# Altium schematic sheet Sheet1.SchDoc
size A; SheetNumber: 1; SheetTotal: 1
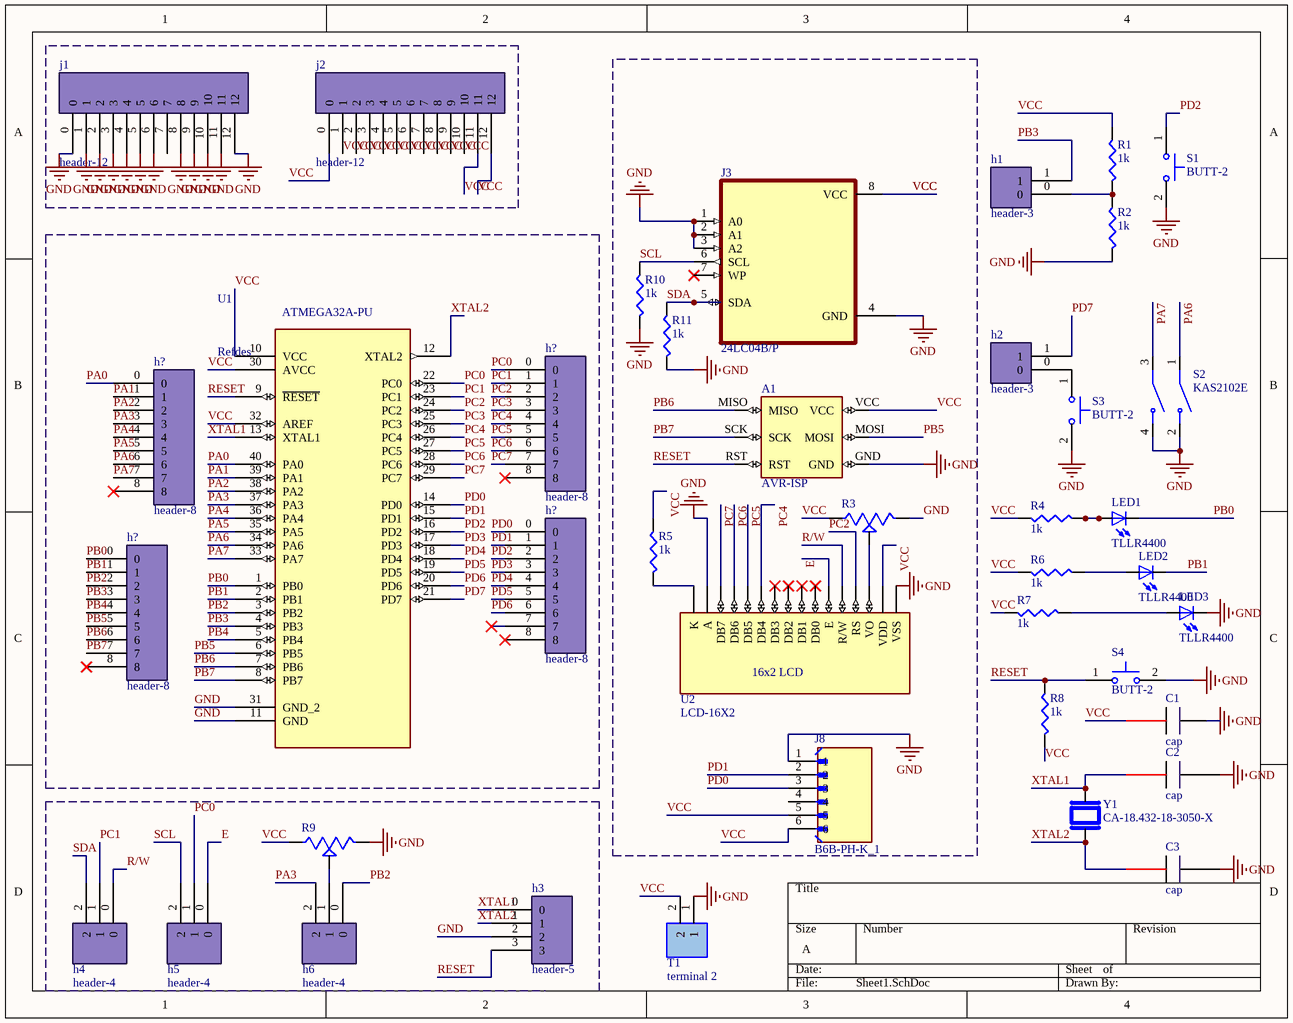
[diagram p0: Sheet1.SchDoc]

## Parts
(Parts that share a designator on the sheet are numbered #1, #2 ... from top to bottom, then left to right.)
A1  AVR-ISP  [AVR-ISP]
C1  cap  [cap]
C2  cap  [cap]
C3  cap  [cap]
h1  header-3  [Male_header_3]
h2  header-3  [Male_header_3]
h3  header-5  [Male_header_5]
h4  header-4  [Male_header_4]
h5  header-4  [Male_header_4]
h6  header-4  [Male_header_4]
h?#1  header-8  [male header 8x2.54]
h?#2  header-8  [male header 8x2.54]
h?#3  header-8  [male header 8x2.54]
h?#4  header-8  [male header 8x2.54]
j1  header-12  [male header 8x2.54]
j2  header-12  [male header 8x2.54]
J3  24LC04B/P  [DIP787W46P254L927H533Q8]
J8  B6B-PH-K_1  [JST_B6B-PH-K]
LED1  TLLR4400  [LED3MM]
LED2  TLLR4400  [LED3MM]
LED3  TLLR4400  [LED3MM]
R1  1k  [R_THT_CFR-25]
R2  1k  [R_THT_CFR-25]
R3  PTN16-A50220K1B1  [POT_PTN16-A50220K1B1]  (value not drawn)
R4  1k  [R_THT_CFR-25]
R5  1k  [R_THT_CFR-25]
R6  1k  [R_THT_CFR-25]
R7  1k  [R_THT_CFR-25]
R8  1k  [R_THT_CFR-25]
R9  PTN16-A50220K1B1  [POT_PTN16-A50220K1B1]  (value not drawn)
R10  1k  [R_THT_CFR-25]
R11  1k  [R_THT_CFR-25]
S1  BUTT-2  [SW_BUTT-2]
S2  KAS2102E  [SW_KAS2102E]
S3  BUTT-2  [SW_BUTT-2]
S4  BUTT-2  [SW_BUTT-2]
T1  terminal 2  [CONN2_0393800102_524X492_MOL]
U1  ATMEGA32A-PU  [3M_240-1280-00-0602J]  (value not drawn)
U2  LCD-16X2  [MODULE_LCD-16X2]
Y1  CA-18.432-18-3050-X  [XTAL_CA-18.432-18-3050-X]

## Nets
GND: A1.GND C1.2 C2.2 C3.2 h3.2 j1.0 j1.1 j1.2 j1.3 j1.4 j1.5 j1.6 j1.8 j1.9 j1.10 j1.11 j1.12 J3.1(A0) J3.2(A1) J3.3(A2) J3.4(GND) J8.1 LED3.K(C) R2.1 R3.3 R9.3 R10.1 R11.1 S1.2 S2.2(NO1) S2.4(NO2) S3.2 S4.2 T1.1 U1.11(GND) U1.31(GND_2) U2.1(VSS) U2.15(A)
E: h5.0 U2.6(E)
PA0: h?#2.0 U1.40(PA0)
PA1: h?#2.1 U1.39(PA1)
PA2: h?#2.2 U1.38(PA2)
PA3: h6.2 h?#2.3 U1.37(PA3)
PA4: h?#2.4 U1.36(PA4)
PA5: h?#2.5 U1.35(PA5)
PA6: h?#2.6 S2.1(COM1) U1.34(PA6)
PA7: h?#2.7 S2.3(COM2) U1.33(PA7)
PB0: h?#4.0 LED1.K(C) U1.1(PB0)
PB1: h?#4.1 LED2.K(C) U1.2(PB1)
PB2: h6.0 h?#4.2 U1.3(PB2)
PB3: h1.1 h?#4.3 U1.4(PB3)
PB4: h?#4.4 U1.5(PB4)
PB5: A1.MOSI h?#4.5 U1.6(PB5)
PB6: A1.MISO h?#4.6 U1.7(PB6)
PB7: A1.SCK h?#4.7 U1.8(PB7)
PC0: h5.1 h?#1.0 U1.22(PC0)
PC1: h4.1 h?#1.1 U1.23(PC1)
PC2: h?#1.2 U1.24(PC2) U2.4(RS)
PC3: h?#1.3 U1.25(PC3)
PC4: h?#1.4 U1.26(PC4) U2.11(DB4)
PC5: h?#1.5 U1.27(PC5) U2.12(DB5)
PC6: h?#1.6 U1.28(PC6) U2.13(DB6)
PC7: h?#1.7 U1.29(PC7) U2.14(DB7)
PD0: h?#3.0 J8.3 U1.14(PD0)
PD1: h?#3.1 J8.2 U1.15(PD1)
PD2: h?#3.2 S1.1 U1.16(PD2)
PD3: h?#3.3 U1.17(PD3)
PD4: h?#3.4 U1.18(PD4)
PD5: h?#3.5 U1.19(PD5)
PD6: h?#3.6 U1.20(PD6)
PD7: h2.1 U1.21(PD7)
R/W: h4.0 U2.5(R/W)
RESET: A1.RST h3.3 R8.2 S4.1 U1.9(~{RESET})
SCL: h5.2 J3.6(SCL) R10.2
SDA: h4.2 J3.5(SDA) R11.2
VCC: A1.VCC C1.1 j2.0 j2.1 j2.2 j2.3 j2.4 j2.5 j2.6 j2.7 j2.8 j2.9 j2.10 j2.11 j2.12 J3.8(VCC) J8.5 J8.6 R1.2 R3.1 R4.1 R5.1 R6.1 R7.2 R8.1 R9.1 T1.2 U1.10(VCC) U1.30(AVCC) U1.32(AREF) U2.2(VDD)
XTAL1: C2.1 h3.0 U1.13(XTAL1) Y1.2
XTAL2: C3.1 h3.1 U1.12(XTAL2) Y1.1
Neth1_0: h1.0 R1.1 R2.2
Neth2_0: h2.0 S3.1
Neth6_1: h6.1 R9.2
NetLED1_A: LED1.A R4.2
NetLED2_A: LED2.A R6.2
NetLED3_A: LED3.A R7.1
NetR3_2: R3.2 U2.3(VO)
NetR5_2: R5.2 U2.16(K)

Not connected (* = marked no-connect by the designer): h?#1 8*; h?#2 8*; h?#3 7* 8*; h?#4 8*; j1 7; J3 7(WP)*; J8 4; U2 7(DB0)* 8(DB1)* 9(DB2)* 10(DB3)*

## Notes on the sheet
- (in symbol ATMEGA32A-PU) Refdes
- (in symbol LCD-16X2) 16x2 LCD

## Library data of the parts
A1 = AVR-ISP: Emulators / Simulators AVR USB IN CIRCUIT EMUL/PRGMR ISP; MF: Gravitech; SnapEDA_Link: https://www.snapeda.com/parts/AVR-ISP/Gravitech/view-part/4593377/?ref=snap; MP: AVR-ISP; Availability: Unavailable; Price: None; Value: *; Package: None
J3 = 24LC04B/P: 4K, 512 X 8 2.5V SERIAL EEPROM | Microchip Technology Inc. 24LC04B/P; SnapEDA_Link: https://www.snapeda.com/parts/24LC04B/P/Microchip+Technology/view-part/?ref=snap; Package: DIP-8 Microchip; Value: *; MF: Microchip; MP: 24LC04B/P; Check_prices: https://www.snapeda.com/parts/24LC04B/P/Microchip+Technology/view-part/?ref=eda
J8 = B6B-PH-K_1: Conn Shrouded Header (4 Sides) HDR 6 POS 2mm Solder ST Top Entry Thru-Hole Box; MF: JST Corporation; SnapEDA_Link: https://www.snapeda.com/parts/B6B-PH-K/JST/view-part/?ref=snap; Package: None; Value: *; MP: B6B-PH-K; Check_prices: https://www.snapeda.com/parts/B6B-PH-K/JST/view-part/?ref=eda
LED1-LED3 = TLLR4400: Red 619nm LED Indication - Discrete 1.9V Radial; MF: Vishay; SnapEDA_Link: https://www.snapeda.com/parts/TLLR4400/Vishay+Semiconductor+Opto+Division/view-part/?ref=snap; Package: None; Value: *; MP: TLLR4400; Check_prices: https://www.snapeda.com/parts/TLLR4400/Vishay+Semiconductor+Opto+Division/view-part/?ref=eda
R1 R2 R4-R8 R10 R11 = TH CFR-25 Resis: CFR Series 0.25 W 1 KOhm ±5 % -350 to 500 ppm/°C Carbon Film Resistor; Manufacturer 1: Yageo; Manufacturer Part Number 1: CFR-25JB-52-1K; Tolerance: 5%; Resistance: 1kR; Max Power Dissipation: 250mW; Parameter Name 1: Bulk; Supplier 1: Digi-Key; Stock 1: 194074; Pricing 1: 1=0.10000, 25=0.04680, 50=0.03640, 100=0.02600, 250=0.02028, 500=0.01612, 750=0.01379, 1000=0.01144, 2000=0.00988 (USD); RoHS: Yes; Case/Package: Axial; Min Operating Temperature: -55°C; Max Operating Temperature: 155°C; Temperature Coefficient: 500ppm/°C; Resistor Type: Carbon Film; Number of Terminations: 2; Package Quantity: 200; Power Rating: 250mW; Length: 0.248inch; Lead Free: Lead Free; ComponentLink1URL: http://www.yageo.com/NewPortal/yageodocoutput?fileName=/pdf/throughhole/Yageo_LR_CFR_2013.pdf&src-supplier=Digi-Key; ComponentLink1Description: http://www.yageo.com/NewPortal/yageodocoutput?fileName=/pdf/throughhole/Yageo_LR_CFR_2013.pdf&src-supplier=Digi-Key; ComponentLink2URL: http://www.yageo.com/documents/recent/General%20Type_CFR.pdf?src-supplier=Future+Electronics; ComponentLink2Description: http://www.yageo.com/documents/recent/General%20Type_CFR.pdf?src-supplier=Future+Electronics; Supplier Part Number 1: 1.0KQBK-ND
R3 R9 = PTN16-A50220K1B1: 16.5 mm, Horizontal, Linear, 50 kÎ©, Through Hole, Knurled Shaft Single Section Rotary Potentiometer; MF: Same Sky; SnapEDA_Link: https://www.snapeda.com/parts/PTN16-A50220K1B1/Same+Sky/view-part/?ref=snap; Package: Package; Value: *; MP: PTN16-A50220K1B1; Check_prices: https://www.snapeda.com/parts/PTN16-A50220K1B1/Same+Sky/view-part/?ref=eda
S1 S3 S4 = BUTT-2: Tactile Switches MINI PUSH BUTTON SWITCH 2-PIN QTY. 4; MF: Gravitech; SnapEDA_Link: https://www.snapeda.com/parts/BUTT-2/Gravitech/view-part/?ref=snap; Package: None; Value: *; MP: BUTT-2; Check_prices: https://www.snapeda.com/parts/BUTT-2/Gravitech/view-part/?ref=eda
S2 = KAS2102E: Dip Switch SPST 2 Position Through Hole, Right Angle Slide (Standard) Actuator 25mA 24VDC; MF: E-Switch; SnapEDA_Link: https://www.snapeda.com/parts/KAS2102E/E-Switch/view-part/?ref=snap; Package: None; Value: *; MP: KAS2102E; Check_prices: https://www.snapeda.com/parts/KAS2102E/E-Switch/view-part/?ref=eda
T1 = terminal 2: Manufacturer: Samtec; Manufacturer Part Number: FTS-102-01-F-S; Manufacturer Series: FTS; Connector Type: BOARD CONNECTOR; Option: General Purpose; Additional Feature: Low Profile; Filter Feature: No; Number of Rows Loaded: 1; Number of Contacts: 2; Supplier: Digikey; Supplier Part Number: SAM15176-ND; RoHS: Yes; Category: Connectors; Stock: 1204; Pricing: 1=0.68, 10=0.592, 100=0.4878, 500=0.4242, 1000=0.34996, 5000=0.30754, 10000=0.28634 (USD); Mounting Technology: Board; Contact Material: Bronze; Contact Finish - Mating: GOLD (3) OVER NICKEL (50); Contact Finish - Termination: Matte Tin (Sn) - with Nickel (Ni) barrier; JESD-609 Code: e3; Contact Gender: Male; Mixed Contacts: No; Mounting Style: STRAIGHT; Termination: Solder; Terminal Pitch: 1.27mm; Flammability Rating: UL94 V-0; DIN Conformance: No; IEC Conformance: No; MIL Conformance: No; Reach SVHC Compliant: Yes; RoHS Compliant: Yes; ComponentLink1URL: https://datasheet.ciiva.com:443/pdfs/VipMasterIC/IC/SAMI/SAMI-S-A0001504673/SAMI-S-A0001504673-1.pdf?src-supplier=IHS+Markit; ComponentLink1Description: https://datasheet.ciiva.com:443/pdfs/VipMasterIC/IC/SAMI/SAMI-S-A0001504673/SAMI-S-A0001504673-1.pdf?src-supplier=IHS+Markit; ComponentLink2URL: http://www.samtec.com/documents/webfiles/pdf/FTS.pdf?src-supplier=Avnet; ComponentLink2Description: http://www.samtec.com/documents/webfiles/pdf/FTS.pdf?src-supplier=Avnet; LCSC Part Number: C6045317
U1 = ATMEGA32A-PU: AVR AVRÂ® ATmega Microcontroller IC 8-Bit 16MHz 32KB (16K x 16) FLASH 40-PDIP; MF: Microchip; SnapEDA_Link: https://www.snapeda.com/parts/ATMEGA32A-PU/Microchip/view-part/?ref=snap; Package: PDIP-40 Microchip; Value: *; MP: ATMEGA32A-PU; Check_prices: https://www.snapeda.com/parts/ATMEGA32A-PU/Microchip/view-part/?ref=eda
U2 = LCD-16X2: Display Development Tools 16x2 Black on Green Char LCD w Backlight; MF: Gravitech; SnapEDA_Link: https://www.snapeda.com/parts/LCD-16X2/Gravitech/view-part/?ref=snap; Package: None; Value: *; MP: LCD-16X2; Check_prices: https://www.snapeda.com/parts/LCD-16X2/Gravitech/view-part/?ref=eda
Y1 = CA-18.432-18-3050-X: Quartz Crystal, HC-49/U-S Short Package; MF: Aker; SnapEDA_Link: https://www.snapeda.com/parts/CA-18.432-18-3050-X/Aker/view-part/?ref=snap; Package: None; Value: *; MP: CA-18.432-18-3050-X; Check_prices: https://www.snapeda.com/parts/CA-18.432-18-3050-X/Aker/view-part/?ref=eda